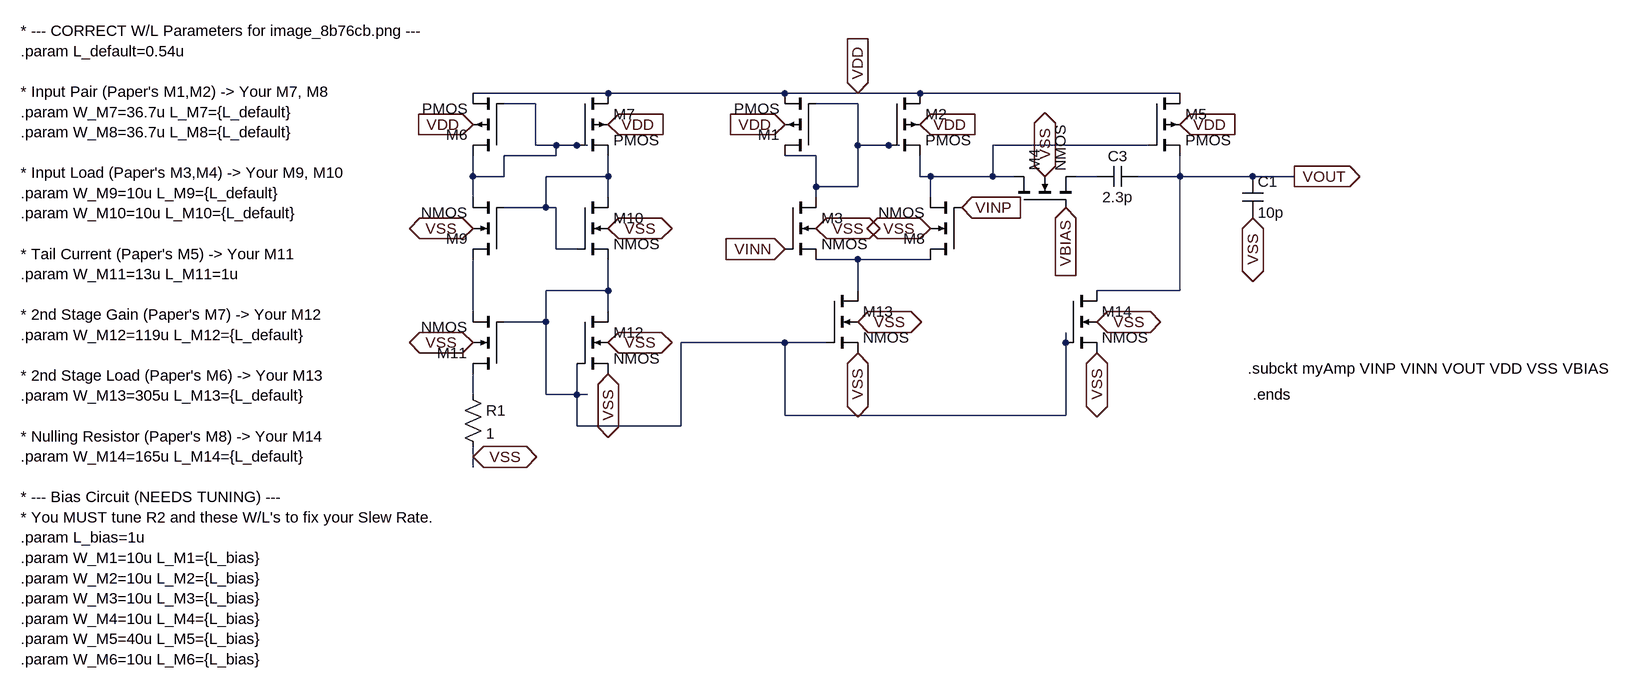
[diagram p0: schematic Draft1.asc]
Draft1.asc, the LTspice schematic file:
Version 4.1
SHEET 1 1512 1464
WIRE -176 144 -384 144
WIRE 96 144 -176 144
WIRE 208 144 96 144
WIRE 304 144 208 144
WIRE 704 144 304 144
WIRE -288 160 -336 160
WIRE 208 160 144 160
WIRE -288 224 -288 160
WIRE -256 224 -288 224
WIRE -224 224 -256 224
WIRE -208 224 -224 224
WIRE 208 224 208 160
WIRE 256 224 208 224
WIRE 272 224 256 224
WIRE 656 224 416 224
WIRE -256 240 -256 224
WIRE -256 240 -336 240
WIRE 144 240 96 240
WIRE -384 272 -384 240
WIRE -336 272 -336 240
WIRE -336 272 -384 272
WIRE -176 272 -176 240
WIRE -176 272 -272 272
WIRE 304 272 304 240
WIRE 320 272 304 272
WIRE 416 272 416 224
WIRE 416 272 320 272
WIRE 448 272 416 272
WIRE 576 272 544 272
WIRE 704 272 704 240
WIRE 704 272 640 272
WIRE 816 272 704 272
WIRE 880 272 816 272
WIRE 144 288 144 240
WIRE 208 288 208 224
WIRE 208 288 144 288
WIRE -384 304 -384 272
WIRE -176 304 -176 272
WIRE 144 304 144 288
WIRE 320 304 320 272
WIRE -272 320 -272 272
WIRE -272 320 -336 320
WIRE -256 320 -272 320
WIRE -256 384 -256 320
WIRE -224 384 -256 384
WIRE 208 400 144 400
WIRE 320 400 208 400
WIRE -176 448 -176 400
WIRE -176 448 -272 448
WIRE 208 448 208 400
WIRE 704 448 704 272
WIRE 704 448 576 448
WIRE -384 480 -384 400
WIRE -176 480 -176 448
WIRE -272 496 -272 448
WIRE -272 496 -336 496
WIRE 96 528 -64 528
WIRE 160 528 96 528
WIRE 528 528 528 512
WIRE -384 608 -384 576
WIRE -272 608 -272 496
WIRE -224 608 -224 560
WIRE -224 608 -272 608
WIRE -208 608 -224 608
WIRE 96 640 96 528
WIRE 528 640 528 528
WIRE 528 640 96 640
WIRE -224 656 -224 608
WIRE -64 656 -64 528
WIRE -64 656 -224 656
WIRE -384 704 -384 688
WIRE -384 720 -384 704
FLAG 880 272 VOUT
IOPIN 880 272 Out
FLAG 576 544 VSS
IOPIN 576 544 BiDir
FLAG 208 544 VSS
IOPIN 208 544 BiDir
FLAG -176 576 VSS
IOPIN -176 576 BiDir
FLAG -384 704 VSS
IOPIN -384 704 BiDir
FLAG 96 384 VINN
IOPIN 96 384 In
FLAG 368 320 VINP
IOPIN 368 320 In
FLAG 528 320 VBIAS
IOPIN 528 320 In
FLAG 208 144 VDD
IOPIN 208 144 In
FLAG -384 192 VDD
IOPIN -384 192 In
FLAG -176 192 VDD
IOPIN -176 192 In
FLAG 96 192 VDD
IOPIN 96 192 In
FLAG 304 192 VDD
IOPIN 304 192 In
FLAG 704 192 VDD
IOPIN 704 192 In
FLAG -384 528 VSS
IOPIN -384 528 BiDir
FLAG -176 528 VSS
IOPIN -176 528 BiDir
FLAG 208 496 VSS
IOPIN 208 496 BiDir
FLAG 576 496 VSS
IOPIN 576 496 BiDir
FLAG -384 352 VSS
IOPIN -384 352 BiDir
FLAG -176 352 VSS
IOPIN -176 352 BiDir
FLAG 496 272 VSS
IOPIN 496 272 BiDir
FLAG 320 352 VSS
IOPIN 320 352 BiDir
FLAG 144 352 VSS
IOPIN 144 352 BiDir
FLAG 816 336 VSS
IOPIN 816 336 BiDir
SYMBOL pmos4 -224 144 R0
SYMATTR InstName M7
SYMATTR Value2 l={L_bias} w={W_M7}
SYMBOL nmos4 -224 304 R0
SYMATTR InstName M10
SYMATTR Value2 l={L_bias} w={W_M10}
SYMBOL nmos4 -224 480 R0
SYMATTR InstName M12
SYMATTR Value2 l={L_bias} w={W_M12}
SYMBOL pmos4 -336 240 R180
SYMATTR InstName M6
SYMATTR Value2 l={L_bias} w={W_M6}
SYMBOL nmos4 -336 400 R180
SYMATTR InstName M9
SYMATTR Value2 l={L_bias} w={W_M9}
SYMBOL nmos4 -336 576 R180
SYMATTR InstName M11
SYMATTR Value2 l={L_bias} w={W_M11}
SYMBOL pmos4 256 144 R0
SYMATTR InstName M2
SYMATTR Value2 l={L_default} w={W_M2}
SYMBOL pmos4 144 240 R180
SYMATTR InstName M1
SYMATTR Value2 l={L_default} w={W_M1}
SYMBOL nmos4 96 304 R0
SYMATTR InstName M3
SYMATTR Value2 l={L_default} w={W_M3}
SYMBOL nmos4 368 400 R180
SYMATTR InstName M8
SYMATTR Value2 l={L_default} w={W_M8}
SYMBOL nmos4 160 448 R0
SYMATTR InstName M13
SYMATTR Value2 l={L_M13} w={W_M13}
SYMBOL nmos4 528 448 R0
SYMATTR InstName M14
SYMATTR Value2 l={L_default} w={W_M14}
SYMBOL nmos4 448 320 R270
SYMATTR InstName M4
SYMATTR Value2 l={L_default} w={W_M4}
SYMBOL cap 640 256 R90
WINDOW 0 0 32 VBottom 2
WINDOW 3 32 32 VTop 2
SYMATTR InstName C3
SYMATTR Value 2.3p
SYMBOL pmos4 656 144 R0
SYMATTR InstName M5
SYMATTR Value2 l={L_default} w={W_M5}
SYMBOL res -400 592 R0
SYMATTR InstName R1
SYMATTR Value 1
SYMBOL cap 800 272 R0
SYMATTR InstName C1
SYMATTR Value 10p
TEXT 808 568 Left 2 !.subckt myAmp VINP VINN VOUT VDD VSS VBIAS
TEXT 816 608 Left 2 !.ends
TEXT -1080 48 Left 2 !* --- CORRECT W/L Parameters for image_8b76cb.png ---\n.param L_default=0.54u\n \n* Input Pair (Paper's M1,M2) -> Your M7, M8\n.param W_M7=36.7u L_M7={L_default}\n.param W_M8=36.7u L_M8={L_default}\n \n* Input Load (Paper's M3,M4) -> Your M9, M10\n.param W_M9=10u L_M9={L_default}\n.param W_M10=10u L_M10={L_default}\n \n* Tail Current (Paper's M5) -> Your M11\n.param W_M11=13u L_M11=1u\n \n* 2nd Stage Gain (Paper's M7) -> Your M12\n.param W_M12=119u L_M12={L_default}\n \n* 2nd Stage Load (Paper's M6) -> Your M13\n.param W_M13=305u L_M13={L_default}\n \n* Nulling Resistor (Paper's M8) -> Your M14\n.param W_M14=165u L_M14={L_default}\n \n* --- Bias Circuit (NEEDS TUNING) ---\n* You MUST tune R2 and these W/L's to fix your Slew Rate.\n.param L_bias=1u\n.param W_M1=10u L_M1={L_bias}\n.param W_M2=10u L_M2={L_bias}\n.param W_M3=10u L_M3={L_bias}\n.param W_M4=10u L_M4={L_bias}\n.param W_M5=40u L_M5={L_bias}\n.param W_M6=10u L_M6={L_bias}

The netlist it stands for:
* Draft1.asc
M7 VDD N001 N004 VDD PMOS l={L_bias} w={W_M7}
M10 N004 N004 N007 VSS NMOS l={L_bias} w={W_M10}
M12 N007 N007 VSS VSS NMOS l={L_bias} w={W_M12}
M6 N001 N001 VDD VDD PMOS l={L_bias} w={W_M6}
M9 N008 N004 N001 VSS NMOS l={L_bias} w={W_M9}
M11 N009 N007 N008 VSS NMOS l={L_bias} w={W_M11}
M2 VDD N002 N003 VDD PMOS l={L_default} w={W_M2}
M1 N002 N002 VDD VDD PMOS l={L_default} w={W_M1}
M3 N002 VINN N006 VSS NMOS l={L_default} w={W_M3}
M8 N006 VINP N003 VSS NMOS l={L_default} w={W_M8}
M13 N006 N007 VSS VSS NMOS l={L_M13} w={W_M13}
M14 VOUT N007 VSS VSS NMOS l={L_default} w={W_M14}
M4 N003 VBIAS N005 VSS NMOS l={L_default} w={W_M4}
C3 VOUT N005 2.3p
M5 VDD N003 VOUT VDD PMOS l={L_default} w={W_M5}
R1 N009 VSS 1
C1 VOUT VSS 10p
.model NMOS NMOS
.model PMOS PMOS
.lib standard.mos
.subckt myAmp VINP VINN VOUT VDD VSS VBIAS
.ends
* --- CORRECT W/L Parameters for image_8b76cb.png ---
.param L_default=0.54u
* Input Pair (Paper's M1,M2) -> Your M7, M8
.param W_M7=36.7u L_M7={L_default}
.param W_M8=36.7u L_M8={L_default}
* Input Load (Paper's M3,M4) -> Your M9, M10
.param W_M9=10u L_M9={L_default}
.param W_M10=10u L_M10={L_default}
* Tail Current (Paper's M5) -> Your M11
.param W_M11=13u L_M11=1u
* 2nd Stage Gain (Paper's M7) -> Your M12
.param W_M12=119u L_M12={L_default}
* 2nd Stage Load (Paper's M6) -> Your M13
.param W_M13=305u L_M13={L_default}
* Nulling Resistor (Paper's M8) -> Your M14
.param W_M14=165u L_M14={L_default}
* --- Bias Circuit (NEEDS TUNING) ---
* You MUST tune R2 and these W/L's to fix your Slew Rate.
.param L_bias=1u
.param W_M1=10u L_M1={L_bias}
.param W_M2=10u L_M2={L_bias}
.param W_M3=10u L_M3={L_bias}
.param W_M4=10u L_M4={L_bias}
.param W_M5=40u L_M5={L_bias}
.param W_M6=10u L_M6={L_bias}
.backanno
.end